# Altium schematic sheet EPS_MPPT_Y_EMI-Filter_In.SchDoc: MPPTY Input EMI Filter
size A4; Date: 2015-10-11; Author: Piotr Kuligowski; Revision: 1-0; SheetTotal: 14; Model: EM1
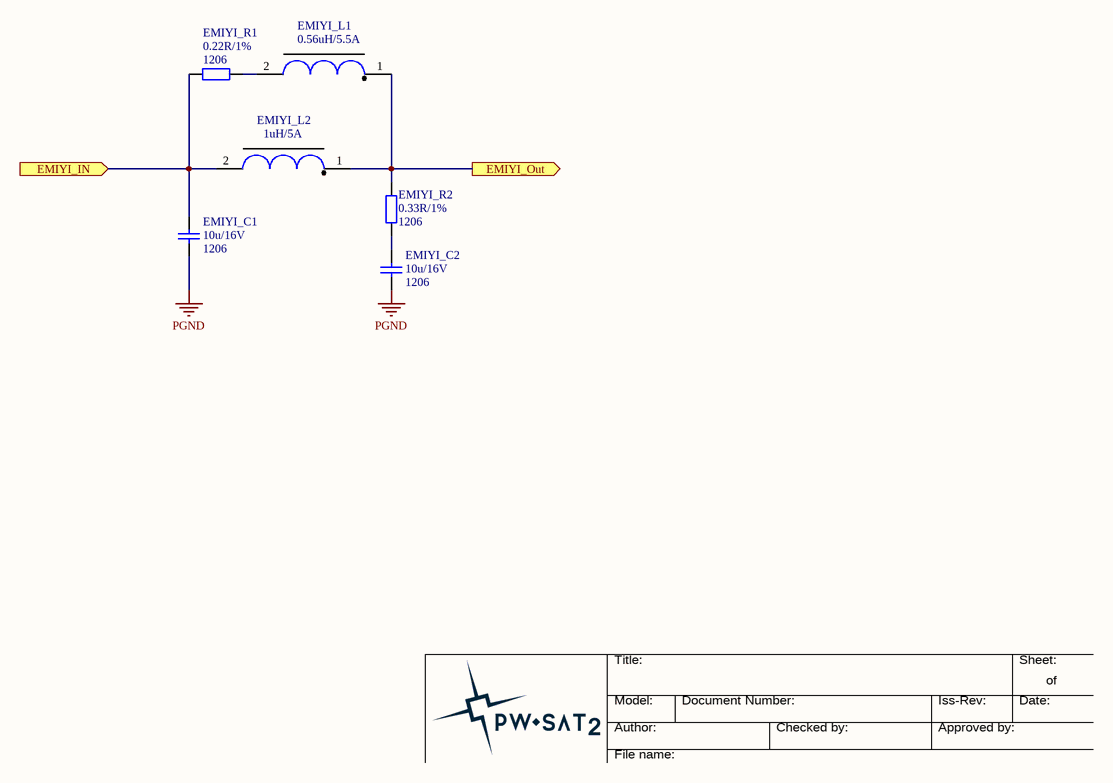
[diagram p0: EPS_MPPT_Y_EMI-Filter_In.SchDoc]

## Parts
EMIYI_C1  Packge: 1206  [SMD_Capacitor_1206]  (hidden comment: 10u/16V)
EMIYI_C2  Packge: 1206  [SMD_Capacitor_1206]  (hidden comment: 10u/16V)
EMIYI_L1  0.56uH/5.5A  [Vishay_IHLP1212]
EMIYI_L2  1uH/5A  [Vishay_IHLP1212]
EMIYI_R1  Package: 1206  [SMD_Resistor_1206]  (hidden comment: 0.22R/1%)
EMIYI_R2  Package: 1206  [SMD_Resistor_1206]  (hidden comment: 0.33R/1%)

## Ports
EMIYI_IN (in), EMIYI_Out (out)

## Nets
PGND: EMIYI_C1.2 EMIYI_C2.2
EMIYI_IN: EMIYI_C1.1 EMIYI_L2.2 EMIYI_R1.1 ; port EMIYI_IN
EMIYI_Out: EMIYI_L1.1 EMIYI_L2.1 EMIYI_R2.2 ; port EMIYI_Out
NetEMIYI_C2_1: EMIYI_C2.1 EMIYI_R2.1
NetEMIYI_L1_2: EMIYI_L1.2 EMIYI_R1.2

## Notes on the sheet
- Title:
- Sheet:
- of
- Author:
- Model:
- Document Number:
- Checked by:
- Iss-Rev:
- Approved by:
- Date:
- File name:

## Library data of the parts
EMIYI_C1 EMIYI_C2 = Cer_C1206T106K4RACTU: Ceramic Cap Kemet COTS 10u/16V X7R 1206; ManufacturerPartNumber: C1206T106K4RACTU; Manufacturer: Kemet; Value: 10u/16V
EMIYI_L1 = IHLP1212BZERR56M11: Vishay IHLP1212 Inductor, L=0.56uH, Irise40deg=5.5A, ESR=16mR, SRF=1MHz.; Manufacturer: Vishay; ManufacturerPartNumber: IHLP1212BZERR56M11; Value: 0.56uH/5.5A
EMIYI_L2 = IHLP1212BZER1R0M11: Vishay IHLP1212 Inductor, L=1uH, Irise40deg=5A, ESR=20mR, SRF=1MHz.; Manufacturer: Vishay; ManufacturerPartNumber: IHLP1212BZER1R0M11; Value: 1uH/5A
EMIYI_R1 = ERJ-8BQFR22V: Panasonic Resistor 0.22R 1% 1206 330mW; Manufacturer: Panasonic; ManufacturerPartNumber: ERJ-8BQFR22V; Value: 0.22R/1%
EMIYI_R2 = ERJ-8BQFR33V: Panasonic Resistor 0.33R 1% 1206 330mW; Manufacturer: Panasonic; ManufacturerPartNumber: ERJ-8BQFR33V; Value: 0.33R/1%